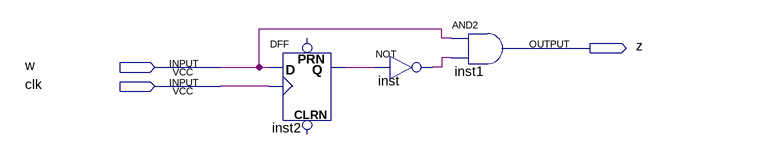
[diagram p0: schematic sheet]
// Quartus schematic buttonProcessing.bdf as structural Verilog: 3 symbols, 3 pins
module buttonProcessing (
  input  w,
  input  clk,
  output z
);

  wire inst2_q, inst_out;

  DFF inst2 (.CLK(clk), .D(w), .Q(inst2_q));  // open: CLRN, PRN
  not inst (inst_out, inst2_q);
  and inst1 (z, w, inst_out);
endmodule
